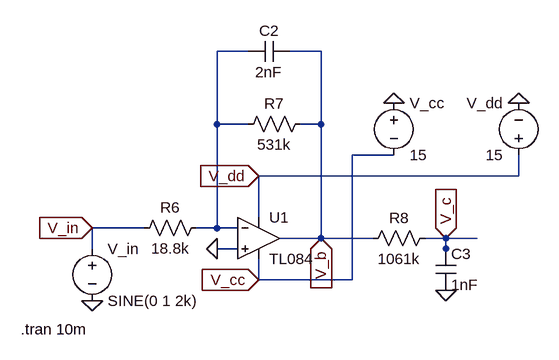
[diagram p0: schematic Experiment_1_a_A.asc]
Experiment_1_a_A.asc, the LTspice schematic file:
Version 4
SHEET 1 880 680
WIRE 272 -160 224 -160
WIRE 384 -160 336 -160
WIRE 224 -48 224 -160
WIRE 272 -48 224 -48
WIRE 384 -48 384 -160
WIRE 384 -48 352 -48
WIRE 496 0 432 0
WIRE 688 32 688 0
WIRE 688 32 288 32
WIRE 288 96 288 32
WIRE 112 112 32 112
WIRE 224 112 224 -48
WIRE 224 112 192 112
WIRE 256 112 224 112
WIRE 384 128 384 -48
WIRE 384 128 320 128
WIRE 464 128 384 128
WIRE 576 128 544 128
WIRE 624 128 576 128
WIRE 32 144 32 112
WIRE 256 144 224 144
WIRE 576 144 576 128
WIRE 576 160 576 144
WIRE 288 192 288 160
WIRE 432 192 432 0
WIRE 432 192 288 192
FLAG 32 224 0
FLAG 224 144 0
FLAG 576 208 0
FLAG 496 -80 0
FLAG 688 -80 0
FLAG 384 128 V_b
IOPIN 384 128 In
FLAG 576 128 V_c
IOPIN 576 128 In
FLAG 32 112 V_in
IOPIN 32 112 In
FLAG 288 192 V_cc
IOPIN 288 192 In
FLAG 288 32 V_dd
IOPIN 288 32 In
SYMBOL res 208 96 R90
WINDOW 0 0 56 VBottom 2
WINDOW 3 32 56 VTop 2
SYMATTR InstName R6
SYMATTR Value 18.8k
SYMBOL res 368 -64 R90
WINDOW 0 0 56 VBottom 2
WINDOW 3 32 56 VTop 2
SYMATTR InstName R7
SYMATTR Value 531k
SYMBOL res 560 112 R90
WINDOW 0 0 56 VBottom 2
WINDOW 3 32 56 VTop 2
SYMATTR InstName R8
SYMATTR Value 1061k
SYMBOL cap 560 144 R0
SYMATTR InstName C3
SYMATTR Value 1nF
SYMBOL cap 336 -176 R90
WINDOW 0 0 32 VBottom 2
WINDOW 3 32 32 VTop 2
SYMATTR InstName C2
SYMATTR Value 2nF
SYMBOL voltage 32 128 R0
WINDOW 123 0 0 Left 0
WINDOW 39 0 0 Left 0
SYMATTR InstName V_in
SYMATTR Value SINE(0 1 2k)
SYMBOL voltage 496 -96 R0
WINDOW 123 0 0 Left 0
WINDOW 39 0 0 Left 0
SYMATTR InstName V_cc
SYMATTR Value 15
SYMBOL voltage 688 16 R180
WINDOW 0 24 96 Left 2
WINDOW 3 24 16 Left 2
WINDOW 123 0 0 Left 0
WINDOW 39 0 0 Left 0
SYMATTR InstName V_dd
SYMATTR Value 15
SYMBOL AutoGenerated\\TL084 288 128 R0
SYMATTR InstName U1
TEXT -78 268 Left 2 !.tran 10m

The netlist it stands for:
* Experiment_1_a_A.asc
R6 N001 V_in 18.8k
R7 V_b N001 531k
R8 V_c V_b 1061k
C3 V_c 0 1nF
C2 V_b N001 2nF
V_in V_in 0 SINE(0 1 2k)
V_cc 0 V_cc 15
V_dd V_dd 0 15
* U1: TL084 (symbol AutoGenerated\TL084 not available, pins judged from their places): In+=0 In-=N001 V+=V_dd V-=V_cc OUT=V_b
.tran 10m
.backanno
.end